# EasyEDA schematic PMD_PROJECT.json
TITLE: 8086; REV: 1.0; Date: 2023-11-04; Sheet: 1/1; Company: Turcin
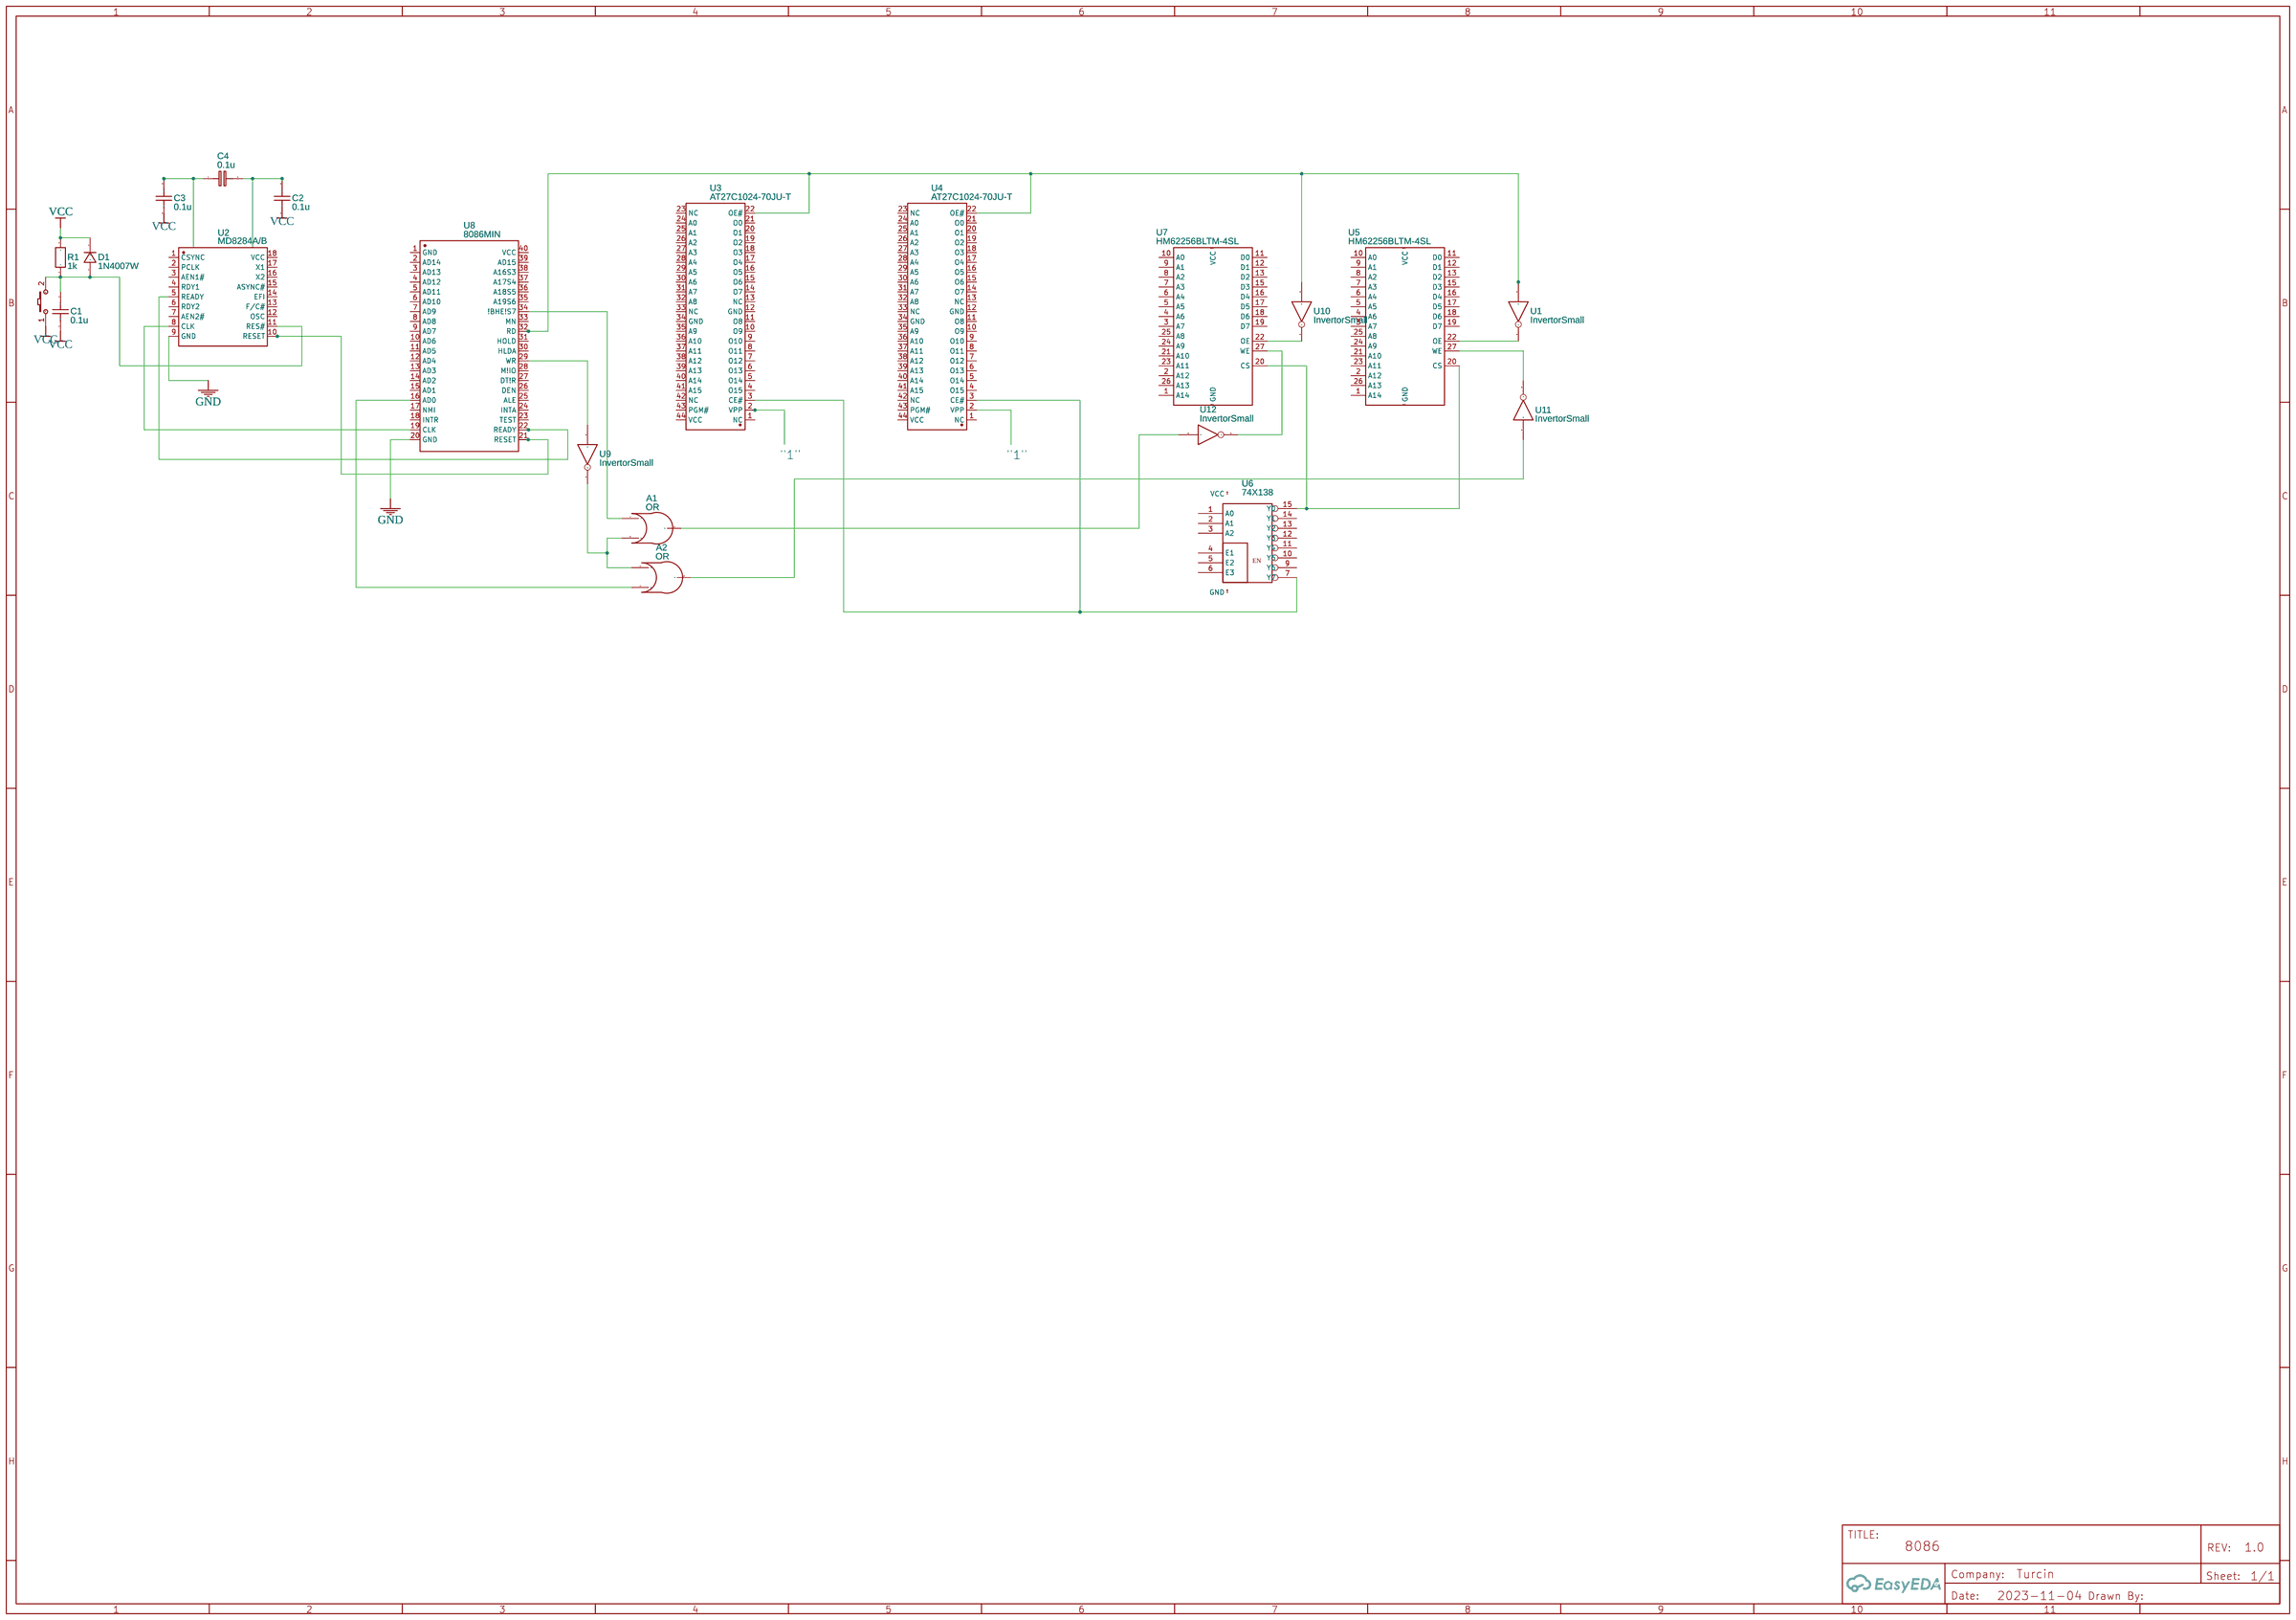
[diagram p0: schematic sheet]

## Parts
A1  OR
A2  OR
C1  0.1u  [C0603]
C2  0.1u  [C0603]
C3  0.1u  [C0603]
C4  0.1u  [C0603]
D1  1N4007W  [SOD-123_L2.8-W1.8-LS3.7-RD]
KEY1  K2-3.6×6.1_SMD  [KEY-SMD_2P-L6.2-W3.6-LS8.0]
R1  1k  [R0603]
U1  InvertorSmall
U2  MD8284A/B  [CDIP-18_L24.4-W6.5-P2.54-LS7.6-BL]
U3  AT27C1024-70JU-T  [PLCC-44_L16.6-W16.6-P1.27-LS17.5-T]
U4  AT27C1024-70JU-T  [PLCC-44_L16.6-W16.6-P1.27-LS17.5-T]
U5  HM62256BLTM-4SL  [TSSOP28]
U6  74X138  [IC16]
U7  HM62256BLTM-4SL  [TSSOP28]
U8  8086MIN  [DIP40]
U9  InvertorSmall
U10  InvertorSmall
U11  InvertorSmall
U12  InvertorSmall

## Library data of the parts
A1 A2 = OR: Contributor: Marco Micheletto
C1-C3 = C_0603_US: Contributor: LCEDA_Lib
C4 = C_0603_EU: Contributor: LCEDA_Lib
D1 = 1N4007W: Supplier: LCSC; Supplier Part: C328592; Manufacturer: BLUE ROCKET; Contributor: LCEDA_Lib
KEY1 = K2-3.6×6.1_SMD: Supplier Part: C118141; Supplier: LCSC; Manufacturer Part: K2-1107ST-A4SW-06; Contributor: LCEDA_Lib; 制造商: 韩国韩荣
R1 = R_0603_EU: Contributor: LCEDA_Lib
U1 U9-U12 = LOGIC: Contributor: Bilal Khan; sim: true
U2 = MD8284A/B: Contributor: lcsc; Supplier: LCSC; Supplier Part: C3610662; Manufacturer: 罗彻斯特; link: https://lcsc.com/eda_search?q=C3610662&%26type=1&ref=editor
U3 U4 = AT27C1024-70JU-T: Contributor: LCSC; Supplier: LCSC; Supplier Part: C2061096; Manufacturer: MICROCHIP(美国微芯); JLCPCB Part Class: Extended Part; link: https://lcsc.com/eda_search?q=C2061096&%26type=1&ref=editor
U5 U7 = HM62256BLTM-4SL: Contributor: KiCad
U6 = 74X138: Contributor: KiCad
U8 = 8086MIN

## Nets
GND: U2.9(GND) U8.20(GND)
VCC: C1.1 D1.1 KEY1.1 R1.2
Net-(A1-1): A1.1 U8.34(!BHE!S7)
Net-(A1-2): A1.2 A2.1 U9.8(1)
Net-(A1-3): A1.3 U12.9(2)
Net-(A2-2): A2.2 U8.16(AD0)
Net-(A2-3): A2.3 U11.9(2)
Net-(C1-2): C1.2 D1.2 KEY1.2 R1.1 U2.11(RES#)
Net-(C2-2): C2.2 C4.2
Net-(C3-2): C3.2 C4.1
Net-(U1-8): U1.8(1) U5.22(OE)
Net-(U1-9): U1.9(2) U3.22(OE#) U4.22(OE#) U8.32(RD) U10.9(2)
Net-(U2-5): U2.5(READY) U8.22(READY)
Net-(U2-8): U2.8(CLK) U8.19(CLK)
Net-(U2-10): U2.10(RESET) U8.21(RESET)
Net-(U3-3): U3.3(CE#) U4.3(CE#) U6.7(Y7)
Net-(U5-20): U5.20(CS) U6.15(Y0) U7.20(CS)
Net-(U5-27): U5.27(WE) U11.8(1)
Net-(U7-22): U7.22(OE) U10.8(1)
Net-(U7-27): U7.27(WE) U12.8(1)
Net-(U8-29): U8.29(WR) U9.9(2)

Not connected (* = marked no-connect by the designer): C2 1; C3 1; U2 1(CSYNC) 2(PCLK) 3(AEN1#) 4(RDY1) 6(RDY2) 7(AEN2#) 12(OSC) 13(F/C#) 14(EFI) 15(ASYNC#) 16(X2) 17(X1) 18(VCC); U3 1(NC) 2(VPP) 4(O15) 5(O14) 6(O13) 7(O12) 8(O11) 9(O10) 10(O9) 11(O8) 12(GND) 13(NC) 14(O7) 15(O6) 16(O5) 17(O4) 18(O3) 19(O2) 20(O1) 21(O0) 23(NC) 24(A0) 25(A1) 26(A2) 27(A3) 28(A4) 29(A5) 30(A6) 31(A7) 32(A8) 33(NC) 34(GND) 35(A9) 36(A10) 37(A11) 38(A12) 39(A13) 40(A14) 41(A15) 42(NC) 43(PGM#) 44(VCC); U4 1(NC) 2(VPP) 4(O15) 5(O14) 6(O13) 7(O12) 8(O11) 9(O10) 10(O9) 11(O8) 12(GND) 13(NC) 14(O7) 15(O6) 16(O5) 17(O4) 18(O3) 19(O2) 20(O1) 21(O0) 23(NC) 24(A0) 25(A1) 26(A2) 27(A3) 28(A4) 29(A5) 30(A6) 31(A7) 32(A8) 33(NC) 34(GND) 35(A9) 36(A10) 37(A11) 38(A12) 39(A13) 40(A14) 41(A15) 42(NC) 43(PGM#) 44(VCC); U5 1(A14) 2(A12) 3(A7) 4(A6) 5(A5) 6(A4) 7(A3) 8(A2) 9(A1) 10(A0) 11(D0) 12(D1) 13(D2) 14(GND) 15(D3) 16(D4) 17(D5) 18(D6) 19(D7) 21(A10) 23(A11) 24(A9) 25(A8) 26(A13) 28(VCC); U6 1(A0) 2(A1) 3(A2) 4(E1) 5(E2) 6(E3) 8(GND) 9(Y6) 10(Y5) 11(Y4) 12(Y3) 13(Y2) 14(Y1) 16(VCC); U7 1(A14) 2(A12) 3(A7) 4(A6) 5(A5) 6(A4) 7(A3) 8(A2) 9(A1) 10(A0) 11(D0) 12(D1) 13(D2) 14(GND) 15(D3) 16(D4) 17(D5) 18(D6) 19(D7) 21(A10) 23(A11) 24(A9) 25(A8) 26(A13) 28(VCC); U8 1(GND) 2(AD14) 3(AD13) 4(AD12) 5(AD11) 6(AD10) 7(AD9) 8(AD8) 9(AD7) 10(AD6) 11(AD5) 12(AD4) 13(AD3) 14(AD2) 15(AD1) 17(NMI) 18(INTR) 23(TEST) 24(INTA) 25(ALE) 26(DEN) 27(DT!R) 28(M!IO) 30(HLDA) 31(HOLD) 33(MN) 35(A19S6) 36(A18S5) 37(A17S4) 38(A16S3) 39(AD15) 40(VCC)

## Notes on the sheet
- "1"
- "1"
